# EAGLE design Review_PCD_1.5 (EAGLE 9.6.2)
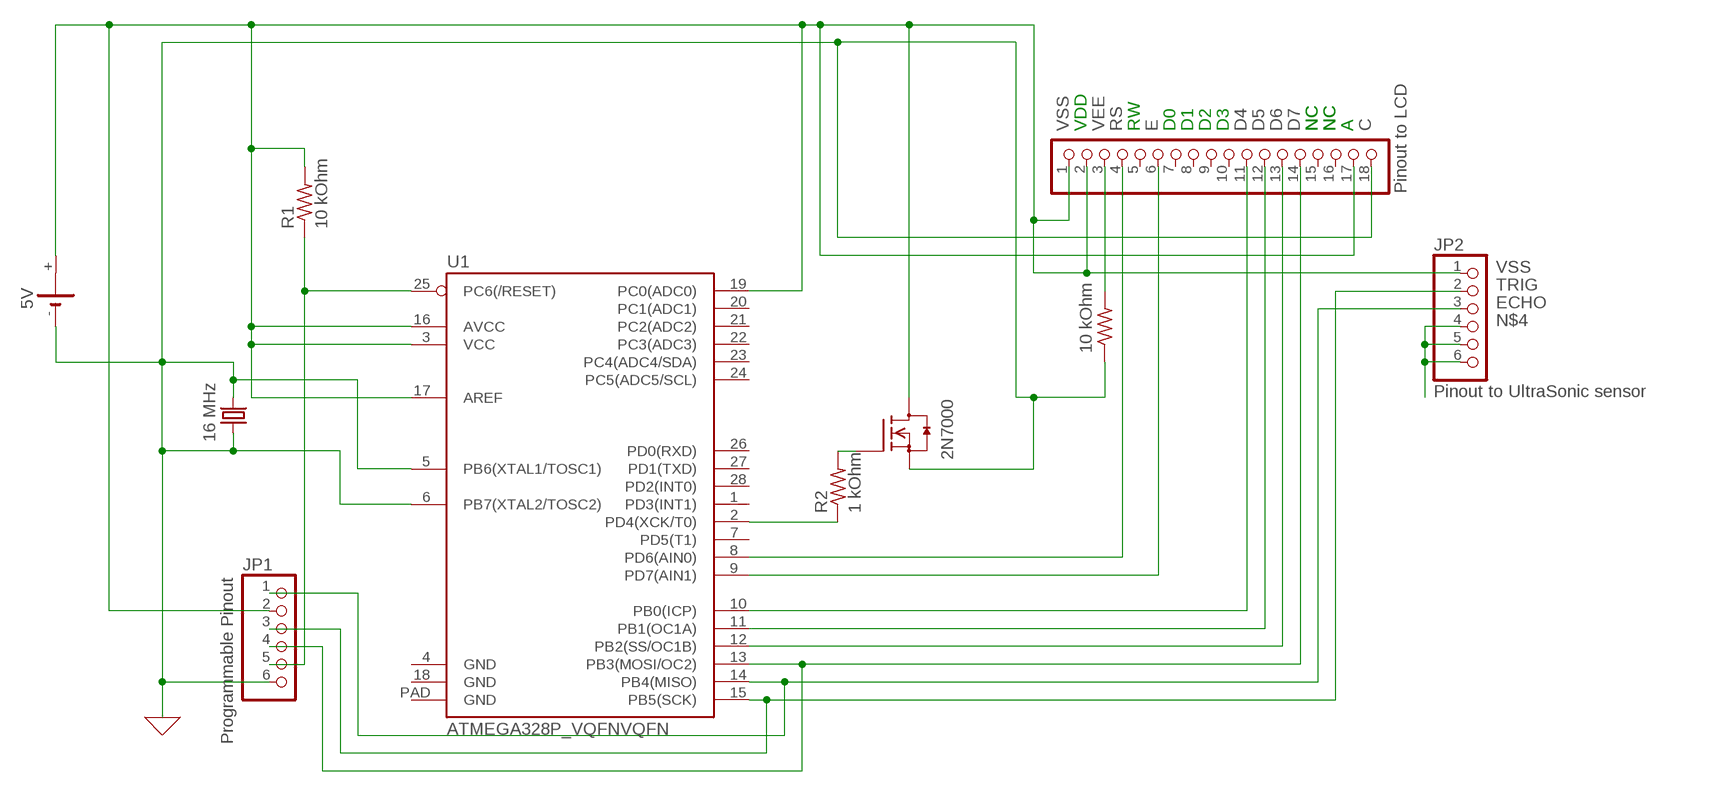
[diagram p0: schematic, sheet 1]

## Parts
5V  CR1/2  [CR1/2]
JP1  Programmable Pinout  PINHD-1X6-3.5MM  [1X06-3.5MM]
JP2  Pinout to UltraSonic sensor  PINHD-1X6B  [1X06-BIG]
JP3  Pinout to LCD  PINHD-1X18  [1X18]
Q1  16 MHz  KX-4  [1.6X1.2]
Q2  2N7000  2N7000KL/BS170KL  [TO92]
R1  10 kOhm  R-US_R2012W  [R2012W]
R2  1 kOhm  R-US_R2012W  [R2012W]
R3  10 kOhm  R-US_R2012W  [R2012W]
U1  ATMEGA328P_VQFNVQFN  [VQFN-28]

## Nets
C: 5V.- JP1.6 JP3.18 Q1.1 Q1.3 Q2.1(S) R3.1 U1.5(PB6(XTAL1/TOSC1)) U1.6(PB7(XTAL2/TOSC2)) ; supply symbol labelled GND
D4: JP3.11 U1.10(PB0(ICP))
D5: JP3.12 U1.11(PB1(OC1A))
D6: JP3.13 U1.12(PB2(SS/OC1B))
D7: JP1.4 JP3.14 U1.13(PB3(MOSI/OC2))
E: JP3.6 U1.9(PD7(AIN1))
ECHO: JP1.1 JP2.3 U1.14(PB4(MISO))
N$1: Q2.2(G) R2.2
N$2: JP1.5 R1.1 U1.25(PC6(/RESET))
N$3: R2.1 U1.2(PD4(XCK/T0))
N$4: JP2.4 JP2.5 JP2.6
RS: JP3.4 U1.8(PD6(AIN0))
TRIG: JP1.3 JP2.2 U1.15(PB5(SCK))
VEE: JP3.3 R3.2
VSS: 5V.+ JP1.2 JP2.1 JP3.1 JP3.2 JP3.17 Q2.3(D) R1.2 U1.3(VCC) U1.16(AVCC) U1.17(AREF) U1.19(PC0(ADC0))
Unconnected: 5V.+@1(+) JP3.5 JP3.7 JP3.8 JP3.9 JP3.10 JP3.15 JP3.16 U1.1(PD3(INT1)) U1.4(GND) U1.7(PD5(T1)) U1.18(GND) U1.20(PC1(ADC1)) U1.21(PC2(ADC2)) U1.22(PC3(ADC3)) U1.23(PC4(ADC4/SDA)) U1.24(PC5(ADC5/SCL)) U1.26(PD0(RXD)) U1.27(PD1(TXD)) U1.28(PD2(INT0)) U1.PAD(GND)

## Notes on the sheet
- VDD | RW | D0 | D1 | D2 | D3 | NC | NC | NC | NC | A

## Library data of the parts
5V = battery:CR1/2: LI BATTERY Sonnenschein SL-350 PT
JP1 JP2 = adafruit:PINHD-1X6: PIN HEADER
JP3 = adafruit:PINHD-1X18: PIN HEADER
Q1 = crystal-geyer_V1_0:KX: Quartz Crystals (MHz) SMD: KX - Serie Model Size l/w/h [mm] Frequency Range Frequency Stability Temp. Range [°C] Load Capacitance AECQ 200 availabel Datasheet KX-4 KX-5 KX-6 KX-7 KX-9A KX-9B KX-12A KX-12B KX-13 KX-20 KX-K KX-KS 1.6/1.2/0.3 2.0/1.6/0.45 2.5/2.0/0.55 3.2/2.5/0.8 5.0/3.2/1.0 5.0/3.2/1.1 6.0/3.5/1.1 6.0/3.5/1.0 7.0/5.0 /1.3 11.6/5.5/1.6 12.3/4.5/4.2 12.3/4.5/3.2 24.0 ~ 80.0 MHz 16.0 ~ 80.0 MHz 12.0 ~ 80.0 MHz 8.0 ~ 60.0 MHz 7,68 ~ 300,0 MHz 8,0 ~ 50,0 MHz 8,0 ~ 150,0 MHz 8,0 ~ 50,0 MHz 6,0 ~ 160,0 MHz 3,579 ~ 25,0 MHz 3,579 ~ 70,0 MHz 3,579 ~ 70,0 MHz ±10 … ±50ppm ±10 … ±50ppm ±10 … ±50ppm ±10 … ±50ppm ±10 … ±50ppm ±10 … ±50ppm ±10 … ±50ppm ±10 … ±50ppm ±10 … ±50ppm ±50ppm ±10 … ±50ppm ±10 … ±50ppm (*) -40°C …+85°C (*) -40°C …+125°C (*) -40°C …+125°C (*) -40°C …+125°C (*) -40°C …+105°C (*) -40°C …+105°C (*) -40°C …+125°C (*) -40°C …+105°C (*) -40°C …+105°C (*) -40°C …+105°C (*) -40°C …+85°C (*) -40°C …+85°C 8, 8…16 8, 8…16 10, 8…16 12, 7…20 16, 10…20 16, 10…20 16, 10…20 16, 12…20 16, 12…20 16, 12…20 16, 12…30 16, 12…30 - yes yes yes - - - - - - - - KX-4.pdf <http://www.geyer-electronic.de/uploads/tx_userartikelfrequenz/GEYER-KX-4.pdf> KX-5.pdf <http://www.geyer-electronic.de/uploads/tx_userartikelfrequenz/GEYER-KX-5.pdf> KX-6.pdf <http://www.geyer-electronic.de/uploads/tx_userartikelfrequenz/GEYER-KX-6.pdf> KX-7.pdf <http://www.geyer-electronic.de/uploads/tx_userartikelfrequenz/GEYER-KX-7.pdf> KX-9A.pdf <http://www.geyer-electronic.de/uploads/tx_userartikelfrequenz/GEYER-KX-9A.pdf> KX-9B.pdf <http://www.geyer-electronic.de/uploads/tx_userartikelfrequenz/GEYER-KX-9B.pdf> KX-12A.pdf <http://www.geyer-electronic.de/uploads/tx_userartikelfrequenz/GEYER-KX-12A.pdf> KX-12B.pdf <http://www.geyer-electronic.de/uploads/tx_userartikelfrequenz/GEYER-KX-12B.pdf> KX-13.pdf <http://www.geyer-electronic.de/uploads/tx_userartikelfrequenz/GEYER-KX-13.pdf> KX-20.pdf <http://www.geyer-electronic.de/uploads/tx_userartikelfrequenz/GEYER-KX-20.pdf> KX-K.pdf <http://www.geyer-electronic.de/uploads/tx_userartikelfrequenz/GEYER-KX-K.pdf> KX-KS.pdf <http://www.geyer-electronic.de/uploads/tx_userartikelfrequenz/GEYER-KX-KS.pdf> <http://www.geyer-electronic.de/fileadmin/template/img/logo-geyer-electronic.png> Details see: http://www.geyer-electronic.de/Frequenz-Produkte.9.0.html Created 2016-06-07, Hans Locher 2016 (C) Geyer Quartz Technology KX4,KX5,KX6,KX7,KX9A,KX9B,KX12A,KX12B,KX13,KX20,KXK,KXKS;1612;2016;2520;3225;5032;6035;7050;11655;12345;1,6x1,2;2,0x1,6;2,5x2,0;3,2x2,5;5,0x3,2;6,0x3,5;7,0x5,0;11,6x5,5;12,3x4,5;12,3x4,5;1.6x1.2;2.0x1.6;2.5x2.0;3.2x2.5;5.0x3.2;6.0x3.5;7.0x5.0;11.6x5.5;12.3x4.5;12.3x4.5;; Q1: 16 MHz
Q2 = m-pad-2.1:2N7000KL/BS170KL: Vishay Siliconix 2N7000KL/BS170KL N-Channel 60-V (D-S) MOSFET FEATURES: TrenchFET Power MOSFET ESD Protected: 2000 V APPLICATIONS: Direct Logic-Level Interface: TTL/CMOS Soild State Relays Drivers: Relays, Solenoids, Lamps, Hammers, Displays, Memories, Transistors, etc. Battery Operated Systems Please send any comments to: messi@users.sourceforge.net
R1 = adafruit:R-US_: RESISTOR, American symbol
R2 = adafruit:R-US_: RESISTOR, American symbol; R1: 1 kOhm
R3 = adafruit:R-US_: RESISTOR, American symbol; R1: 10 kOhm
U1 = SparkFun-IC-Microcontroller:ATMEGA328P_VQFN: Atmel 328P QFN part not in catalog

## Board
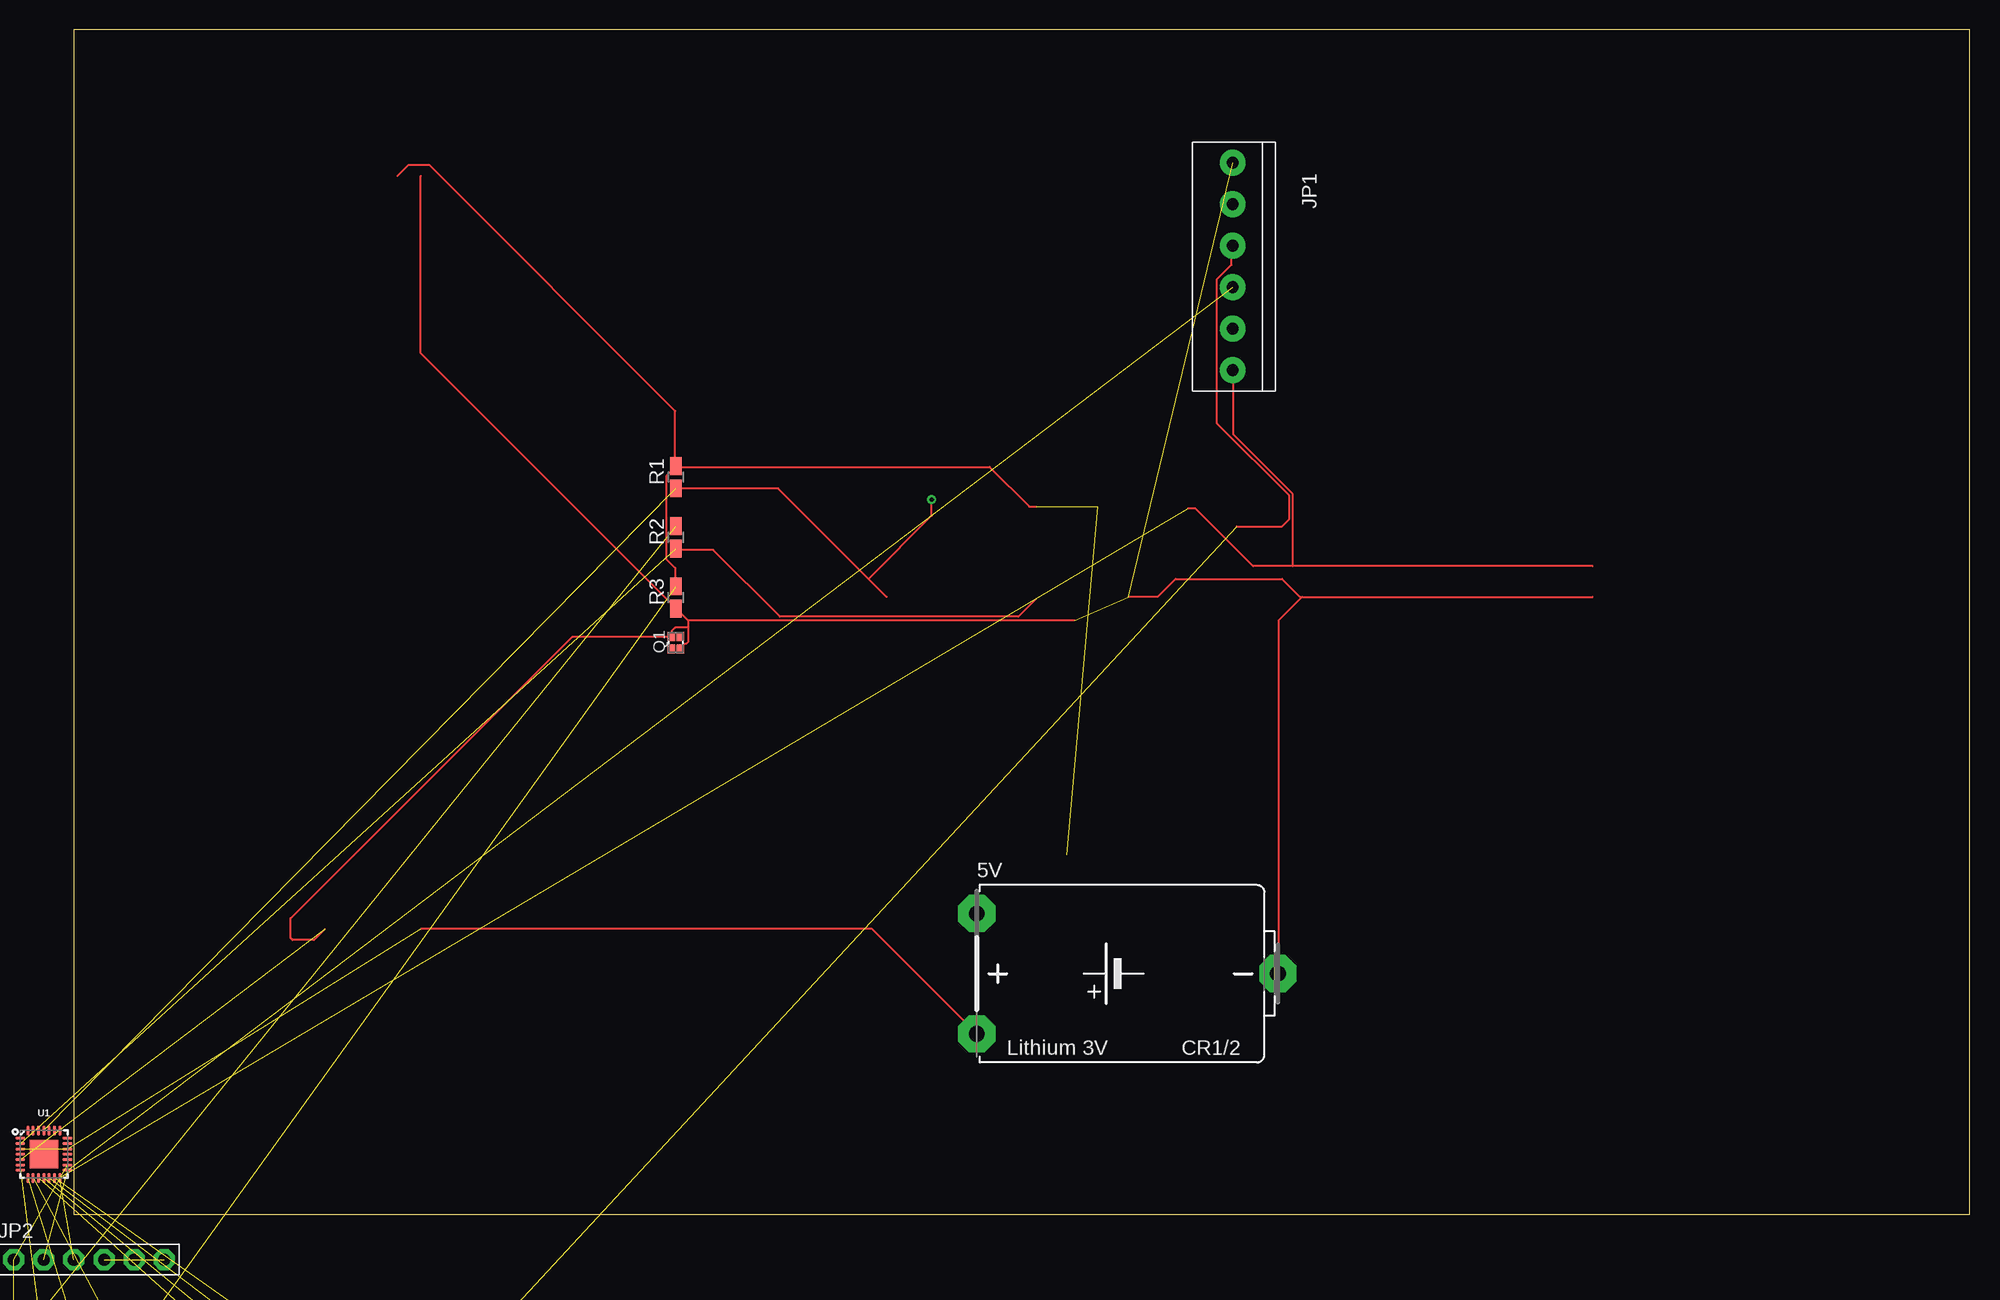
[diagram p1: board, top side]
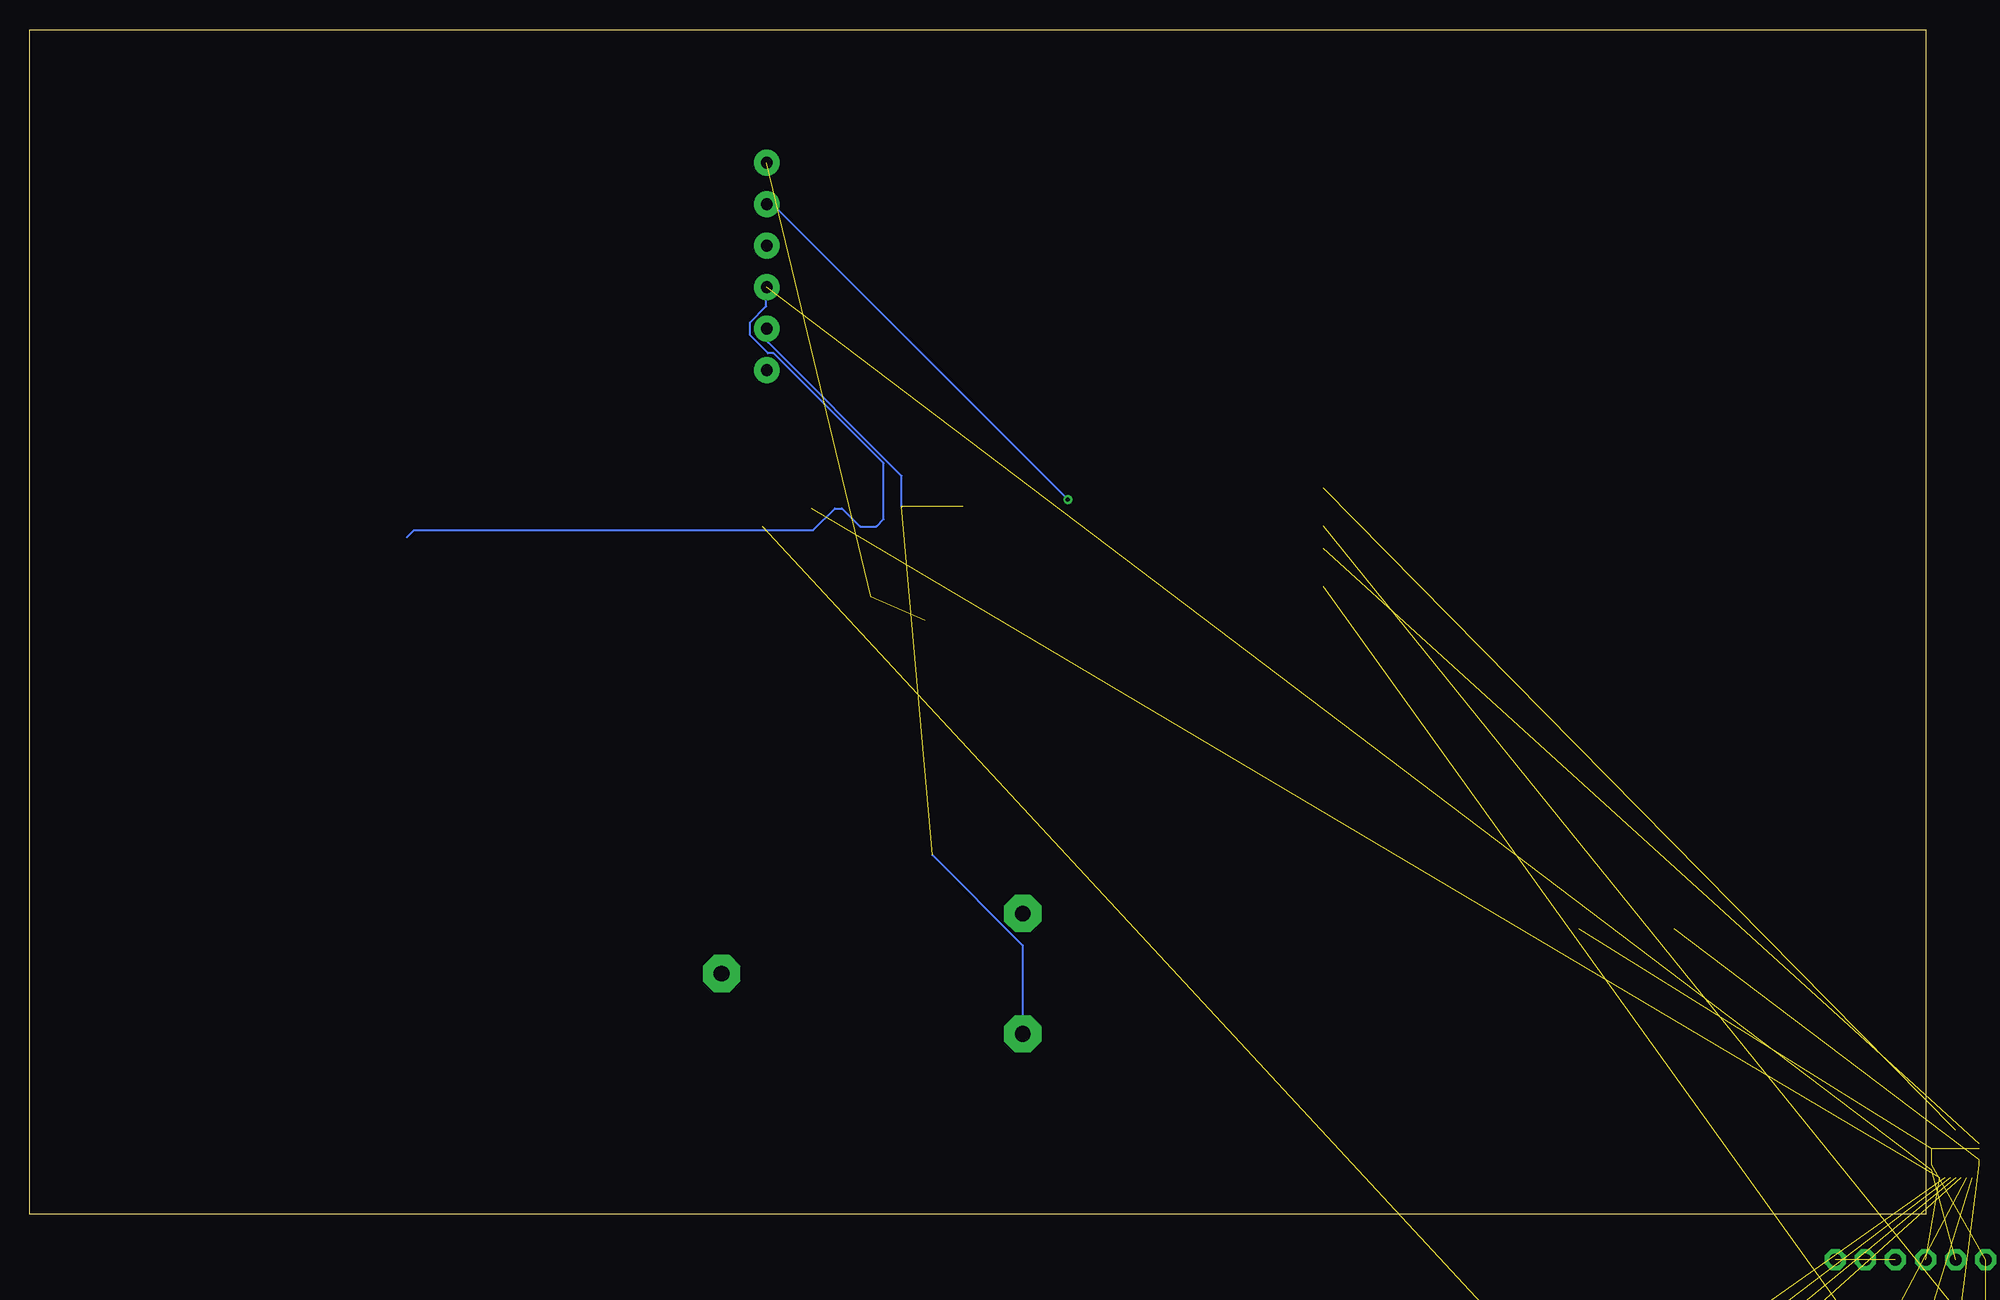
[diagram p2: board, bottom side, seen from below]

Size 160 x 100 mm. Coordinates in mm from the lower left corner, seen from the top.
Outline: 0,0 160,0 160,100 0,100 0,0
Copper layers (1*16): Top 0.035mm / dielectric 0.15mm / Bottom 0.035mm
Design rules "default": minimum track width 6mil, minimum drill 0.35mm, track to track 6mil, track to pad 6mil, pad to pad 6mil, via to via 6mil, smd to smd 6mil, copper to edge 40mil, drill to drill 6mil, minimum pad ring 10mil, minimum via ring 8mil, stop-mask expansion 4mil, vias tented up to drill 0mil, thermal gap 10mil

### Footprints (pad centres in the part's own frame; a part is rotated, then mirrored left to right if it is on the bottom)
CR1/2 = drill 1.321 pad 3.15 octagon: + -12.7,-5.08; +@1 -12.7,5.08; - 12.7,0
1X06-3.5MM = drill 1 pad 2.184: 1 -8.75,0; 2 -5.25,0; 3 -1.75,0; 4 1.75,0; 5 5.25,0; 6 8.75,0
1X06-BIG = drill 1.016 pad 1.778 octagon: 1 -6.35,0; 2 -3.81,0; 3 -1.27,0; 4 1.27,0; 5 3.81,0; 6 6.35,0
1X18 = drill 1.016 long: 1 -21.59,0; 2 -19.05,0; 3 -16.51,0; 4 -13.97,0; 5 -11.43,0; 6 -8.89,0; 7 -6.35,0; 8 -3.81,0; 9 -1.27,0; 10 1.27,0; 11 3.81,0; 12 6.35,0; 13 8.89,0; 14 11.43,0; 15 13.97,0; 16 16.51,0; 17 19.05,0; 18 21.59,0
1.6X1.2 = smd 0.75 x 0.65: 1 -0.525,-0.375; 2 0.525,-0.375; 3 0.525,0.375; 4 -0.525,0.375
TO92 = drill 0.813 octagon: 1 1.27,0; 2 0,1.905; 3 -1.27,0
R2012W = smd 1.5 x 1: 1 -0.94,0; 2 0.94,0
VQFN-28 = smd 0.82 x 0.24: 1 -2,1.35; 2 -2,0.9; 3 -2,0.45; 4 -2,0; 5 -2,-0.45; 6 -2,-0.9; 7 -2,-1.35; 15 2,-1.35; 16 2,-0.9; 17 2,-0.45; 18 2,0; 19 2,0.45; 20 2,0.9; 21 2,1.35 | smd 0.24 x 0.82: 8 -1.35,-2; 9 -0.9,-2; 10 -0.45,-2; 11 0,-2; 12 0.45,-2; 13 0.9,-2; 14 1.35,-2; 22 1.35,2; 23 0.9,2; 24 0.45,2; 25 0,2; 26 -0.45,2; 27 -0.9,2; 28 -1.35,2 | smd 2.4 x 2.4: PAD 0,0

### Placement (x,y rotation side)
5V  88.9,20.32 0 top
JP1  97.79,80.01 90 top
JP2  1.27,-3.81 0 top  (outside the outline)
JP3  16.51,-17.78 0 top  (outside the outline)
Q1  50.8,48.26 90 top
Q2  -3.81,-11.43 0 top  (outside the outline)
R1  50.8,62.23 90 top
R2  50.8,57.15 90 top
R3  50.8,52.07 90 top
U1  -2.54,5.08 0 top

### Tracks (layer width: path | path; a pad name or v marks a point on that pad's centre or on a via)
C  (6 unrouted)
  Top 0.152: 89,52.12 91.44,52.12 92.96,53.65 101.96,53.65 103.48,52.12 103.63,52.12 | 103.63,52.12 128.17,52.12 | 103.63,52.12 101.65,50.14 101.65,20.42 5V.- | 51.82,50.14 51.82,49.53 | 51.82,49.53 51.82,48.31 51.66,48.16 51.51,48.16 51.21,47.85 Q1.1 | 51.82,50.14 50.9,51.05 R3.1 50.75,51.21 29.26,72.69 29.26,87.63 | 51.82,49.53 50.75,49.53 50.44,49.23 50.44,48.92 Q1.3 50.29,48.77 42.06,48.77 18.29,24.99 18.29,23.32 18.44,23.16 20.27,23.16 21.18,24.08 | 84.43,50.14 51.82,50.14
D4  (1 unrouted)
D5  (1 unrouted)
D6  (1 unrouted)
D7  (2 unrouted)
  Top 0.152: 98.15,58.06 101.96,58.06 102.56,58.67 102.56,60.66 96.47,66.75 96.47,78.94 97.69,80.16 97.69,81.69 JP1.4
E  (1 unrouted)
ECHO  (2 unrouted)
  Top 0.152: 94.03,59.59 94.64,59.59 99.52,54.71 102.87,54.71 | 128.17,54.71 102.87,54.71 | 102.87,54.71 102.87,60.81 97.84,65.84 97.84,71.17 JP1.1
N$1  (1 unrouted)
N$2  (via drill 0.35)  (1 unrouted)
  Top 0.152: 68.58,52.12 67.06,53.65 | 67.06,53.65 59.44,61.27 50.9,61.27 R1.1 | v72.39,60.35 72.39,58.98 67.06,53.65
  Bottom 0.152: v72.39,60.35 97.23,85.19 97.69,85.19 JP1.5
N$3  (1 unrouted)
  Top 0.152: 81.23,51.97 79.7,50.44 59.59,50.44 53.95,56.08 50.9,56.08 R2.1
N$4  (2 unrouted)
RS  (1 unrouted)
TRIG  (2 unrouted)
  Bottom 0.152: 128.17,57.15 127.56,57.76 93.88,57.76 92.05,59.59 91.44,59.59 89.92,58.06 88.54,58.06 87.94,58.67 87.94,63.4 97.23,72.69 97.69,72.69 99.21,74.22 99.21,75.29 97.84,76.66 97.84,78.18 JP1.3
VEE  (1 unrouted)
VSS  (11 unrouted)
  Top 0.152: 29.26,24.08 67.36,24.08 5V.+ | 50.75,53.03 50.75,54.56 49.99,55.32 49.99,62.33 50.75,63.09 R1.2 | 27.28,87.63 28.19,88.54 30.02,88.54 50.75,67.82 50.75,63.25 R1.2 | 81.23,59.74 80.62,59.74 77.27,63.09 50.9,63.09 R1.2
  Bottom 0.152: 5V.+ 76.2,22.71 83.82,30.33 | 86.41,59.74 86.41,62.33 97.69,73.61 97.69,74.68 JP1.2